# Altium schematic sheet regulators.SchDoc
size A
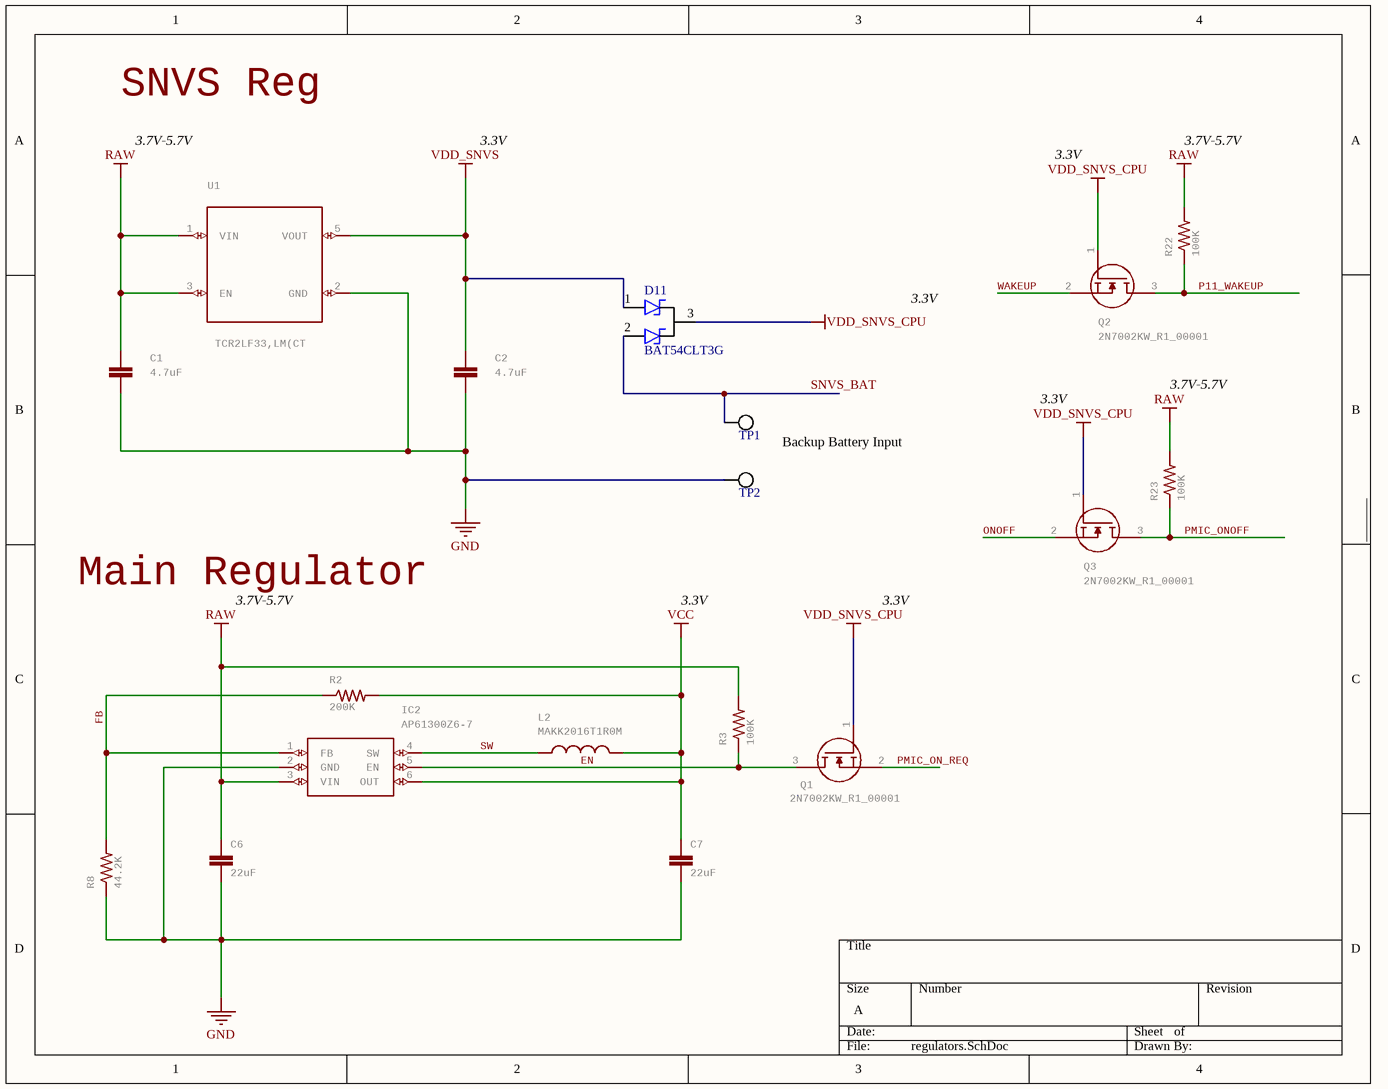
[diagram p0: regulators.SchDoc]

## Parts
C1  4.7uF  [0402-CAP]
C2  4.7uF  [0402-CAP]
C6  22uF  [0805]
C7  22uF  [0805]
D11  MPN: BAT54CLT3G  [SOT-23-3]  (hidden comment: Dual Schottky)
IC2  AP61300Z6-7  [SOTFL50P162X60-6N]
L2  MAKK2016T1R0M  [INDC2016X100N]
Q1  2N7002KW_R1_00001  [SOT65P210X110-3N]
Q2  2N7002KW_R1_00001  [SOT65P210X110-3N]
Q3  2N7002KW_R1_00001  [SOT65P210X110-3N]
R2  200K  [0402-RES]
R3  100K  [0402-RES]
R8  44.2K  [0402-RES]
R22  100K  [0402-RES]
R23  100K  [0402-RES]
TP1  TP  [TP_1p8]  (value not drawn)  (no BOM)
TP2  TP  [TP_1p8]  (value not drawn)  (no BOM)
U1  TCR2LF33,LM(CT  [SOT-23-5]

## Nets
GND: C1.1 C2.1 C6.2 C7.2 IC2.2(GND) R8.1 TP2.1 U1.2(GND)
RAW: C1.2 C6.1 IC2.3(VIN) R3.2 R22.2 R23.2 U1.1(VIN) U1.3(EN)
VCC: C7.1 IC2.6(OUT) L2.2 R2.2
VDD_SNVS: C2.2 D11.1 U1.5(VOUT)
VDD_SNVS_CPU: D11.3 Q1.1(G) Q2.1(G) Q3.1(G)
EN: IC2.5(EN) Q1.3(D) R3.1
FB: IC2.1(FB) R2.1 R8.2
ONOFF: Q3.2(S)
P11_WAKEUP: Q2.3(D) R22.1
PMIC_ON_REQ: Q1.2(S)
PMIC_ONOFF: Q3.3(D) R23.1
SNVS_BAT: D11.2 TP1.1
SW: IC2.4(SW) L2.1
WAKEUP: Q2.2(S)

## Notes on the sheet
- SNVS Reg
- 3.7V-5.7V
- 3.3V
- Backup Battery Input
- Main Regulator

## Library data of the parts
C1 C2 = CAP0402-CAP: CapacitorStandard 0603 ceramic capacitor, and 0.1" leaded capacitor.; MPN: JMK105BBJ475MV-F; GateName_1: G$1; SymbolName_1: CAP; DeviceName: 0402-CAP; LibraryName: sfe; DeviceSetName: CAP; Part Number: JMK105BBJ475MV-F
C6 C7 = 22UF-0805-6.3V-20%: 22ÂµF ceramic capacitors    A capacitor is a passive two-terminal electrical component used to store electrical energy temporarily in an electric field.; MPN: CL21A226MQQNNNE; GateName_1: G$1; SymbolName_1: CAP; PROD_ID: CAP-08402; DeviceName: -0805-6.3V-20%; LibraryName: SparkFun-Capacitors; DeviceSetName: 22UF; Part Number: CL21A226MQQNNNE
D11 = Dual Schottky: Value: ?V; Part Number: BAT54CLT3G
IC2 = AP61300Z6-7: DCDC Conv LV Buck SOT563 T&R 3K   Source:  Datasheet; MANUFACTURER_NAME: Diodes Inc.; GateName_1: G$1; SymbolName_1: AP61300Z6-7; LibraryName: AP61300Z6-7; DeviceSetName: AP61300Z6-7; HEIGHT: 0.6mm; MANUFACTURER_PART_NUMBER: AP61300Z6-7; MOUSER_PART_NUMBER: 621-AP61300Z6-7; MOUSER_PRICE-STOCK: https://www.mouser.co.uk/ProductDetail/Diodes-Incorporated/AP61300Z6-7?qs=HBWAp0VN4Ri0dzb0XP2pEA%3D%3D; MPN: AP61300Z6-7; Part Number: AP61300Z6-7
L2 = MAKK2016T1R0M: Ind Power Wirewound 1uH 20% 2MHz Metal 2200mA 0806 Check availability; GateName_1: G$1; MF: Taiyo Yuden; SymbolName_1: MAKK2016T1R0M; LibraryName: MAKK2016T1R0M; DeviceSetName: MAKK2016T1R0M; AVAILABILITY: In Stock; MP: MAKK2016T1R0M; MPN: MAKK2016T1R0M; PACKAGE: 2016 Taiyo Yuden; PRICE: None; PURCHASE-URL: https://pricing.snapeda.com/search/part/MAKK2016T1R0M/?ref=eda; Part Number: MAKK2016T1R0M
Q1-Q3 = 2N7002KW_R1_00001: MOSFET 60V N-Channel Enhancement Mode MOSFET - ESD Protected   Source:  Datasheet; MANUFACTURER_NAME: PANJIT; GateName_1: G$1; SymbolName_1: 2N7002KW_R1_00001; LibraryName: 2N7002KW_R1_00001; DeviceSetName: 2N7002KW_R1_00001; HEIGHT: 1.1mm; MANUFACTURER_PART_NUMBER: 2N7002KW_R1_00001; MOUSER_PART_NUMBER: 241-2N7002KWR100001; MOUSER_PRICE-STOCK: https://www.mouser.co.uk/ProductDetail/Panjit/2N7002KW_R1_00001?qs=sPbYRqrBIVliWKATqv7jNA%3D%3D; MPN: 2N7002KW_R1_00001; Part Number: 2N7002KW_R1_00001
R2 = RESISTOR0402-RES: ResistorBasic schematic elements and footprints for 0603, 1206, and PTH resistors.; MPN: CRCW0402200KFKEDC; GateName_1: G$1; SymbolName_1: RESISTOR; DeviceName: 0402-RES; LibraryName: sfe; DeviceSetName: RESISTOR; Part Number: CRCW0402200KFKEDC
R3 R22 R23 = RESISTOR0402-RES: ResistorBasic schematic elements and footprints for 0603, 1206, and PTH resistors.; MPN: AC0402FR-07100KL; GateName_1: G$1; SymbolName_1: RESISTOR; DeviceName: 0402-RES; LibraryName: sfe; DeviceSetName: RESISTOR; Part Number: AC0402FR-07100KL
R8 = RESISTOR0402-RES: ResistorBasic schematic elements and footprints for 0603, 1206, and PTH resistors.; MPN: AC0402FR-0744K2L; GateName_1: G$1; SymbolName_1: RESISTOR; DeviceName: 0402-RES; LibraryName: sfe; DeviceSetName: RESISTOR; Part Number: AC0402FR-0744K2L
U1 = TCR2LF33,LM(CT: GateName_1: G$1; SymbolName_1: TCR2LF33,LM(CT; LibraryName: TCR2LF33,LM(CT; DeviceSetName: TCR2LF33,LM(CT; MPN: TCR2LF33,LM(CT